# EAGLE schematic backfin_wifi (EAGLE 6.3)
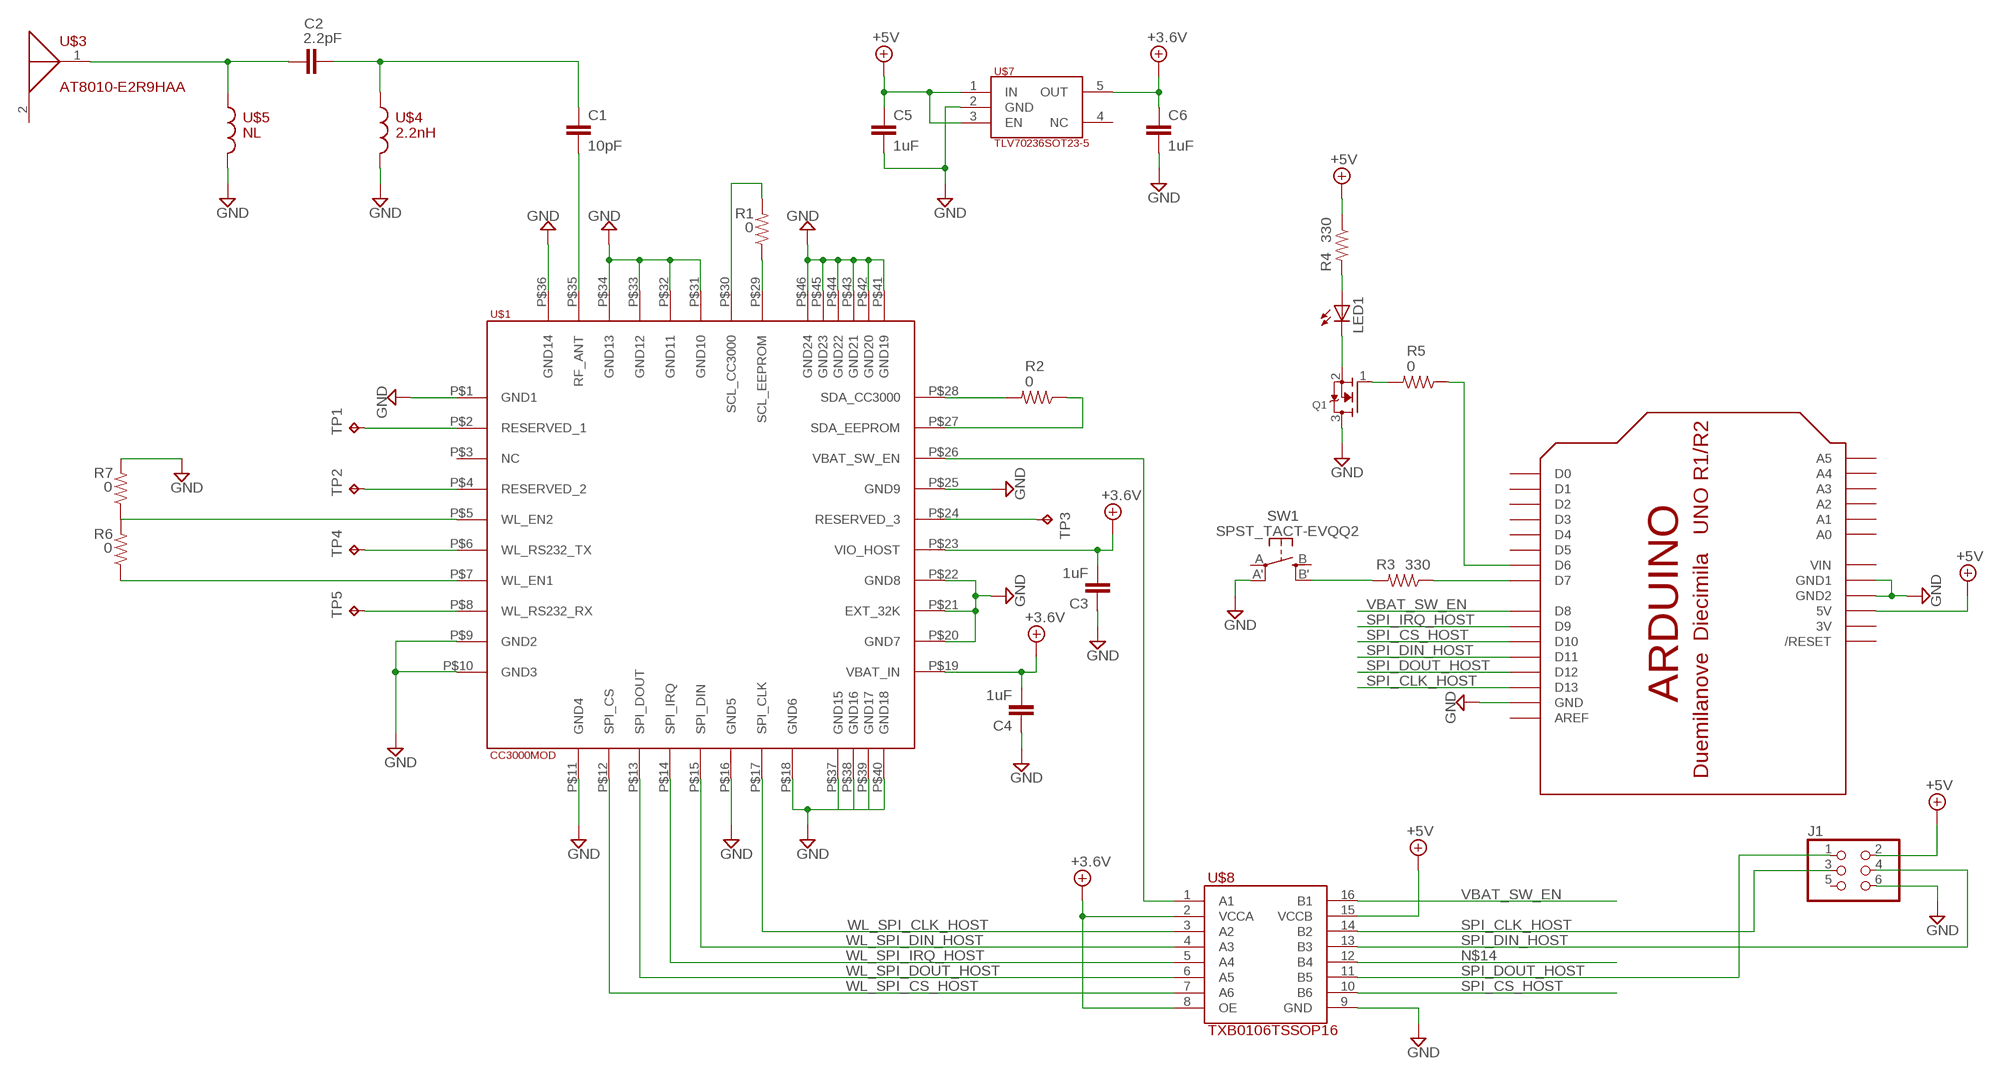
[diagram p0: schematic, sheet 1]

## Parts
C1  10pF  C-EUC0402K  [C0402K]
C2  2.2pF  C-EUC0402K  [C0402K]
C3  1uF  C-EUC0402K  [C0402K]
C4  1uF  C-EUC0402K  [C0402K]
C5  1uF  C-EUC0402K  [C0402K]
C6  1uF  C-EUC0402K  [C0402K]
J1  PINHD-2X3  [2X03]
LED1  LEDCHIPLED_1206  [CHIPLED_1206]
Q1  MOSFET-NREFLOW  [SOT23]
R1  0  R-US_R1005  [R1005]
R2  0  R-US_R1005  [R1005]
R3  330  R-US_R1005  [R1005]
R4  330  R-US_R1005  [R1005]
R5  0  R-US_R1005  [R1005]
R6  0  R-US_R1005  [R1005]
R7  0  R-US_R1005  [R1005]
SW1  SPST_TACT-EVQQ2  [EVQ-Q2]
TP1  TPPAD1-13  [P1-13]
TP2  TPPAD1-13  [P1-13]
TP3  TPPAD1-13  [P1-13]
TP4  TPPAD1-13  [P1-13]
TP5  TPPAD1-13  [P1-13]
U$1  CC3000MOD  [CC3000MOD]
U$2  ARDUINOUNO  [ARDUINO]
U$3  AT8010-E2R9HAA  [AT8010-E2R9HAA]
U$4  2.2nH  INDUCTOR  [0402]
U$5  NL  INDUCTOR  [0402]
U$7  TLV70236SOT23-5  [SOT23-DBV]
U$8  TXB0106TSSOP16  [TSSOP16]

## Nets
+4.1V: C3.2 C4.2 C6.1 U$1.P$19(VBAT_IN) U$1.P$23(VIO_HOST) U$7.5(OUT) U$8.2(VCCA) U$8.8(OE) ; supply symbol labelled +3.6V
+5V: C5.1 J1.2 R4.1 U$2.5V U$7.1(IN) U$7.3(EN) U$8.15(VCCB)
GND: C3.1 C4.1 C5.2 C6.2 J1.6 Q1.3(D) R7.2 SW1.A'(P1) U$1.P$1(GND1) U$1.P$9(GND2) U$1.P$10(GND3) U$1.P$11(GND4) U$1.P$16(GND5) U$1.P$18(GND6) U$1.P$20(GND7) U$1.P$21(EXT_32K) U$1.P$22(GND8) U$1.P$25(GND9) U$1.P$31(GND10) U$1.P$32(GND11) U$1.P$33(GND12) U$1.P$34(GND13) U$1.P$36(GND14) U$1.P$37(GND15) U$1.P$38(GND16) U$1.P$39(GND17) U$1.P$40(GND18) U$1.P$41(GND19) U$1.P$42(GND20) U$1.P$43(GND21) U$1.P$44(GND22) U$1.P$45(GND23) U$1.P$46(GND24) U$2.GND U$2.GND1 U$2.GND2 U$4.2 U$5.2 U$7.2(GND) U$8.9(GND)
N$1: R6.1 U$1.P$7(WL_EN1)
N$2: R6.2 R7.1 U$1.P$5(WL_EN2)
N$3: TP1.TP U$1.P$2(RESERVED_1)
N$4: TP2.TP U$1.P$4(RESERVED_2)
N$5: TP4.TP U$1.P$6(WL_RS232_TX)
N$6: TP5.TP U$1.P$8(WL_RS232_RX)
N$7: TP3.TP U$1.P$24(RESERVED_3)
N$8: R2.2 U$1.P$28(SDA_CC3000)
N$9: R2.1 U$1.P$27(SDA_EEPROM)
N$10: R1.1 U$1.P$29(SCL_EEPROM)
N$11: R1.2 U$1.P$30(SCL_CC3000)
N$12: C1.2 U$1.P$35(RF_ANT)
N$13: C1.1 C2.2 U$4.1
N$14: U$8.12(B4)
N$15: C2.1 U$3.1(FEED) U$5.1
N$16: U$1.P$26(VBAT_SW_EN) U$8.1(A1)
N$17: R3.1 U$2.D7
N$18: R3.2 SW1.B'(S1)
N$19: R5.1 U$2.D6
N$20: LED1.C Q1.2(S)
N$21: LED1.A R4.2
N$22: Q1.1(G) R5.2
SPI_CLK_HOST: J1.3 U$2.D13 U$8.14(B2)
SPI_CS_HOST: U$2.D10 U$8.10(B6)
SPI_DIN_HOST: J1.4 U$2.D11 U$8.13(B3)
SPI_DOUT_HOST: J1.1 U$2.D12 U$8.11(B5)
SPI_IRQ_HOST: U$2.D9
VBAT_SW_EN: U$2.D8 U$8.16(B1)
WL_SPI_CLK_HOST: U$1.P$17(SPI_CLK) U$8.3(A2)
WL_SPI_CS_HOST: U$1.P$12(SPI_CS) U$8.7(A6)
WL_SPI_DIN_HOST: U$1.P$15(SPI_DIN) U$8.4(A3)
WL_SPI_DOUT_HOST: U$1.P$13(SPI_DOUT) U$8.6(A5)
WL_SPI_IRQ_HOST: U$1.P$14(SPI_IRQ) U$8.5(A4)
Unconnected: J1.5 SW1.A(P) SW1.B(S) U$1.P$3(NC) U$2.A0 U$2.A1 U$2.A2 U$2.A3 U$2.A4 U$2.A5 U$2.AREF U$2.D0 U$2.D1 U$2.D2 U$2.D3 U$2.D4 U$2.D5 U$2.RESET(/RESET) U$3.2(NC) U$7.4(NC)

## Power pins joined to a net without a drawn wire
3V: U$2.3V
VIN: U$2.VIN

## Library data of the parts
C1-C4 = rcl:C-EU: CAPACITOR, European symbol
C5 C6 = resistor:C-EU: CAPACITOR, European symbol
J1 = pinhead:PINHD-2X3: PIN HEADER
LED1 = adafruit:LED: LED OSRAM: - CHIPLED LG R971, LG N971, LY N971, LG Q971, LY Q971, LO R971, LY R971 LH N974, LH R974 LS Q976, LO Q976, LY Q976 LO Q996 - Hyper CHIPLED LW Q18S LB Q993, LB Q99A, LB R99A - SideLED LS A670, LO A670, LY A670, LG A670, LP A670 LB A673, LV A673, LT A673, LW A673 LH A674 LY A675 LS A676, LA A676, LO A676, LY A676, LW A676 LS A679, LY A679, LG A679 - Hyper Micro SIDELED® LS Y876, LA Y876, LO Y876, LY Y876 LT Y87S - SmartLED LW L88C, LW L88S LB L89C, LB L89S, LG L890 LS L89K, LO L89K, LY L89K LS L896, LA L896, LO L896, LY L896 - TOPLED LS T670, LO T670, LY T670, LG T670, LP T670 LSG T670, LSP T670, LSY T670, LOP T670, LYG T670 LG T671, LOG T671, LSG T671 LB T673, LV T673, LT T673, LW T673 LH T674 LS T676, LA T676, LO T676, LY T676, LB T676, LH T676, LSB T676, LW T676 LB T67C, LV T67C, LT T67C, LS T67K, LO T67K, LY T67K, LW E67C LS E67B, LA E67B, LO E67B, LY E67B, LB E67C, LV E67C, LT E67C LW T67C LS T679, LY T679, LG T679 LS T770, LO T770, LY T770, LG T770, LP T770 LB T773, LV T773, LT T773, LW T773 LH T774 LS E675, LA E675, LY E675, LS T675 LS T776, LA T776, LO T776, LY T776, LB T776 LHGB T686 LT T68C, LB T68C - Hyper Mini TOPLED® LB M676 - Mini TOPLED Santana® LG M470 LS M47K, LO M47K, LY M47K Source: http://www.osram.convergy.de/
Q1 = adafruit:MOSFET-N: N-Channel Mosfet 2N7002E - 60V 260mA SOT23 [Digikey: 2N7002ET1GOSTR-ND] - REEL BSH103 - 30V 850mA SOT23 [Digikey: 568-5013-1-ND]
R1-R7 = resistor:R-US_: RESISTOR, American symbol
SW1 = adafruit:SPST_TACT: SMT 6mm switch, EVQQ2 series http://www.ladyada.net/library/eagle
TP1-TP5 = testpad:TP: Test pad
U$1 = custom:CC3000MOD: Wi-Fi 802.11b/g Network Processor
U$2 = adafruit:ARDUINO: Arduino Diecimila/Duemilanove Make a shield with ease, this package has all the named pins as well as the two mounting drill holes and an outline of the USB and DC power connector. The outline is on the DIMENSION layer, so if your board house uses it they will cut the outline to match. http://www.ladyada.net/library/pcb/eaglelibrary.html
U$3 = custom:AT8010-E2R9HAA: 2.4-GHz chip antenna, 8.0 × 1.0 mm
U$4 U$5 = custom:INDUCTOR: Inductor
U$7 = custom:TLV70236: Regulator LDO 3.6V 300mA
U$8 = custom:TXB0106: 6 Bit Non-inverting Voltage Level Translator